# Altium schematic sheet mechanical.SchDoc: Mechanical
size Letter; CompanyName: Signal Laboratories, Inc.; DrawnBy: J. Brinton; Engineer: J. Brinton; Address1: 3479 Edison Way; Address2: Menlo Park CA 94025; Address3: +1 (877) 778-8435; Address4: siglabs.com; Revision: 1; SheetNumber: 7; SheetTotal: 7
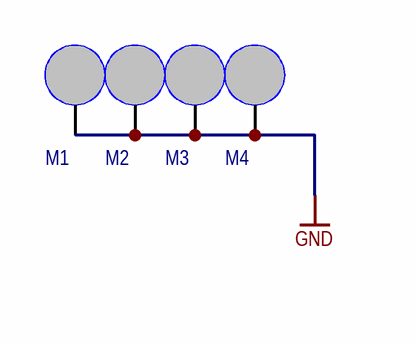
[diagram p0: mechanical.SchDoc]

## Parts
M1  MOUNTM3_CORNERS  [MOUNTM3_CORNERS]  (value not drawn)  (no BOM)
M2  MOUNTM3_CORNERS  [MOUNTM3_CORNERS]  (value not drawn)  (no BOM)
M3  MOUNTM3_CORNERS  [MOUNTM3_CORNERS]  (value not drawn)  (no BOM)
M4  MOUNTM3_CORNERS  [MOUNTM3_CORNERS]  (value not drawn)  (no BOM)

## Nets
GND: M1.1(MNT) M2.1(MNT) M3.1(MNT) M4.1(MNT)

## Notes on the sheet
- Title
- Engineer
- Revision
- Drawn By
- Checked By
- Date
- Sheet
- of

## Library data of the parts
M1-M4 = MOUNT: Manufacturer: *; Manufacturer P/N: *